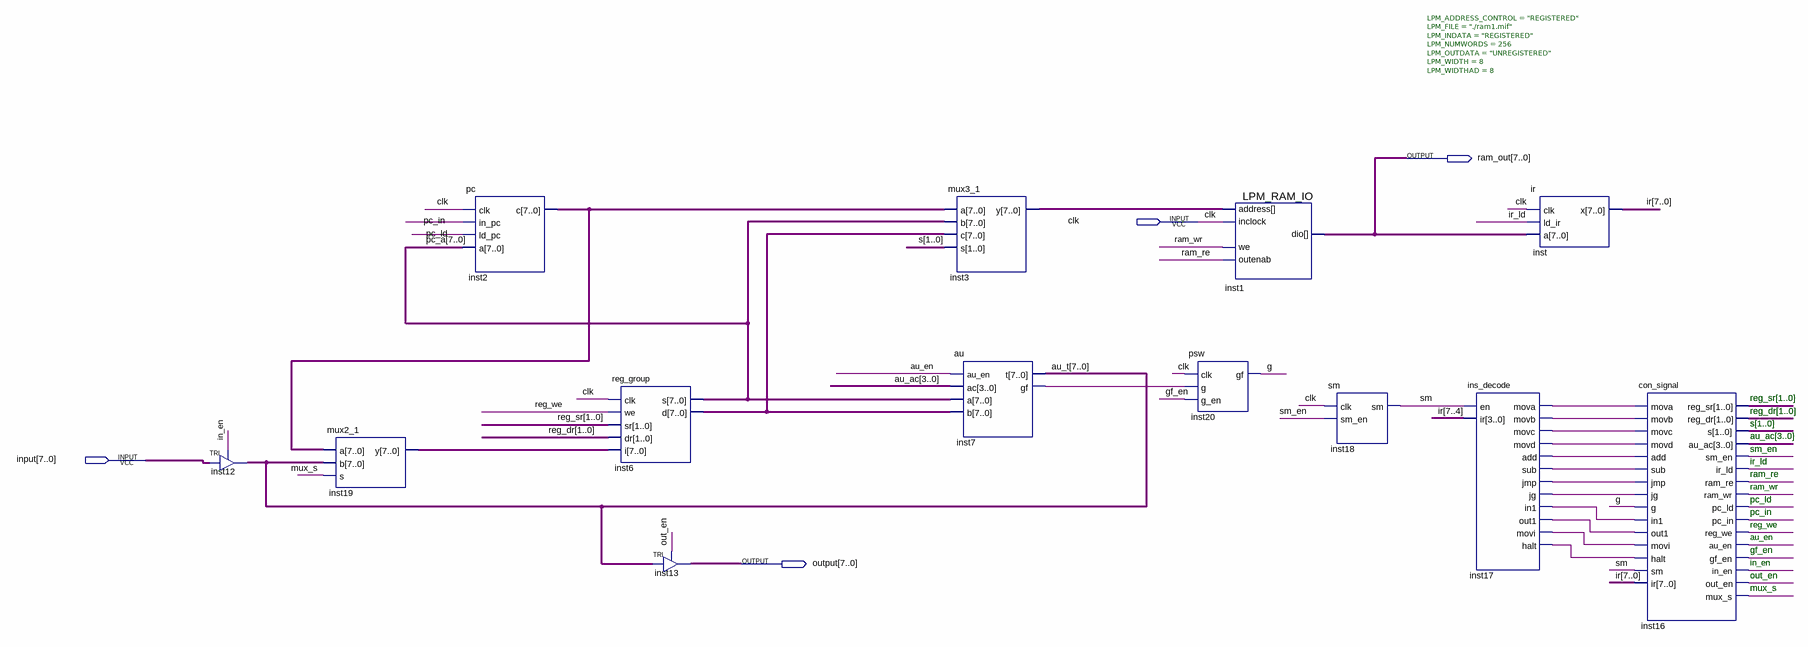
[diagram p0: schematic sheet]
// Quartus schematic Gcpu.bdf as structural Verilog: 13 symbols, 4 pins
module Gcpu (
  input  clk,
  input  [7:0] \input ,
  output [7:0] ram_out,
  output [7:0] \output 
);

  wire au_en, g, gf_en, in_en, inst7_gf, inst17_add, inst17_halt, inst17_in1, inst17_jg, inst17_jmp,
       inst17_mova, inst17_movb, inst17_movc, inst17_movd, inst17_movi, inst17_out1, inst17_sub, ir_ld,
       mux_s, out_en, pc_in, pc_ld, ram_re, ram_wr, reg_we, sm, sm_en;
  wire [1:0] reg_dr, reg_sr, s;
  wire [3:0] au_ac;
  wire [7:0] au_t, inst2_c, inst3_y, inst6_d, inst19_y, ir, pc_a;

  TRI inst12[7:0] (.IN(\input ), .OE(in_en), .OUT(au_t));
  mux2_1 inst19 (.a(inst2_c), .b(au_t), .s(mux_s), .y(inst19_y));
  pc inst2 (.clk(clk), .in_pc(pc_in), .ld_pc(pc_ld), .a(pc_a), .c(inst2_c));
  reg_group inst6 (.clk(clk), .we(reg_we), .sr(reg_sr), .dr(reg_dr), .i(inst19_y), .s(pc_a), .d(inst6_d));
  TRI inst13[7:0] (.IN(au_t), .OE(out_en), .OUT(\output ));
  mux3_1 inst3 (.a(inst2_c), .b(pc_a), .c(inst6_d), .s(s), .y(inst3_y));
  au inst7 (.au_en(au_en), .ac(au_ac), .a(pc_a), .b(inst6_d), .t(au_t), .gf(inst7_gf));
  psw inst20 (.clk(clk), .g(inst7_gf), .g_en(gf_en), .gf(g));
  LPM_RAM_IO #(.LPM_ADDRESS_CONTROL("REGISTERED"), .LPM_FILE("./ram1.mif"), .LPM_INDATA("REGISTERED"), .LPM_NUMWORDS(256), .LPM_OUTDATA("UNREGISTERED"), .LPM_WIDTH(8), .LPM_WIDTHAD(8)) inst1 (
    .address(inst3_y), .inclock(clk), .we(ram_wr), .outenab(ram_re), .dio(ram_out));
  sm inst18 (.clk(clk), .sm_en(sm_en), .sm(sm));
  ins_decode inst17 (
    .en(sm), .ir(ir[7:4]), .mova(inst17_mova), .movb(inst17_movb), .movc(inst17_movc), .movd(inst17_movd),
    .add(inst17_add), .sub(inst17_sub), .jmp(inst17_jmp), .jg(inst17_jg), .in1(inst17_in1),
    .out1(inst17_out1), .movi(inst17_movi), .halt(inst17_halt));
  ir inst (.clk(clk), .ld_ir(ir_ld), .a(ram_out), .x(ir));
  con_signal inst16 (
    .mova(inst17_mova), .movb(inst17_movb), .movc(inst17_movc), .movd(inst17_movd), .add(inst17_add),
    .sub(inst17_sub), .jmp(inst17_jmp), .jg(inst17_jg), .g(g), .in1(inst17_in1), .out1(inst17_out1),
    .movi(inst17_movi), .halt(inst17_halt), .sm(sm), .ir(ir), .reg_sr(reg_sr), .reg_dr(reg_dr), .s(s),
    .au_ac(au_ac), .sm_en(sm_en), .ir_ld(ir_ld), .ram_re(ram_re), .ram_wr(ram_wr), .pc_ld(pc_ld),
    .pc_in(pc_in), .reg_we(reg_we), .au_en(au_en), .gf_en(gf_en), .in_en(in_en), .out_en(out_en),
    .mux_s(mux_s));

  // Notes on the sheet:
  //   reg_sr[1..0]
  //   reg_dr[1..0]
  //   s[1..0]
  //   au_ac[3..0]
  //   sm_en
  //   ir_ld
  //   ram_re
  //   ram_wr
  //   pc_ld
  //   pc_in
  //   reg_we
  //   au_en
  //   gf_en
  //   in_en
  //   out_en
  //   mux_s
endmodule
